# Altium schematic sheet 07-USB.SchDoc
size B
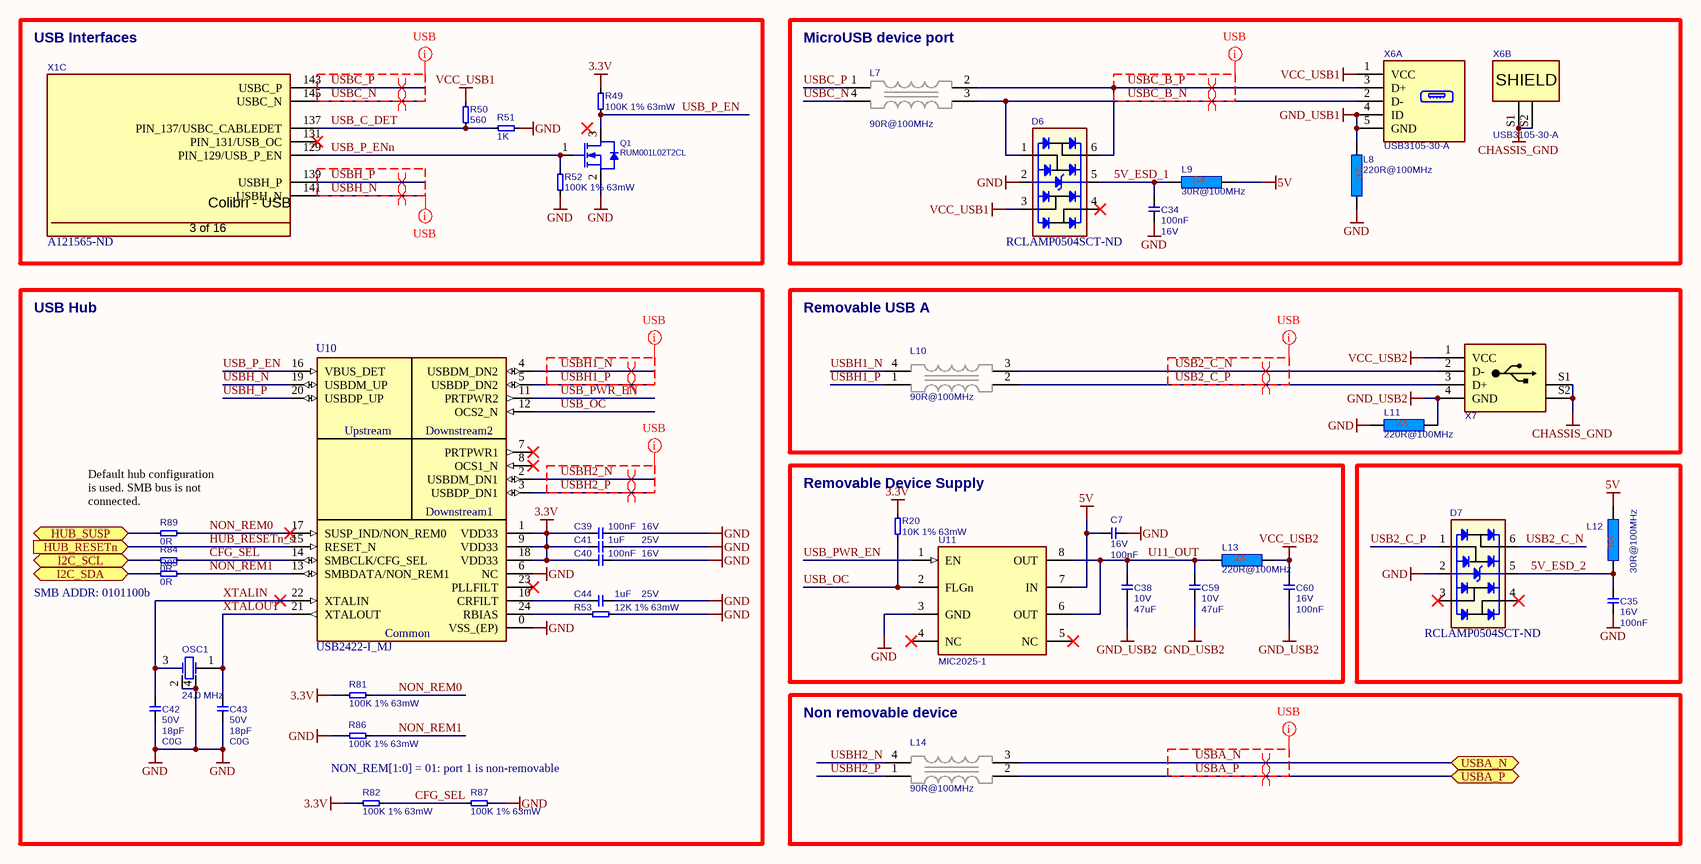
[diagram p0: 07-USB.SchDoc]

## Parts
C7  value 100nF  Rating: 16V  [CAPC1005X60N]  (hidden comment: 100nF 16V 10% X7R)
C34  value 100nF  Rating: 16V  [CAPC1005X60N]  (hidden comment: 100nF 16V 10% X7R)
C35  value 100nF  Rating: 16V  [CAPC1005X60N]  (hidden comment: 100nF 16V 10% X7R)
C38  value 47uF  Rating: 10V  [CAPC3225X160N]  (hidden comment: 47uF 10V 20% X5R)
C39  value 100nF  Rating: 16V  [CAPC1005X60N]  (hidden comment: 100nF 16V 10% X7R)
C40  value 100nF  Rating: 16V  [CAPC1005X60N]  (hidden comment: 100nF 16V 10% X7R)
C41  value 1uF  Rating: 25V  [T_CAPC0805X125N]  (hidden comment: 1uF 25V 10% X7R)
C42  value 18pF  Rating: 50V  Type: C0G  [T_CAPC0603X33N]  (hidden comment: 18pF 50V 5% C0G)
C43  value 18pF  Rating: 50V  Type: C0G  [T_CAPC0603X33N]  (hidden comment: 18pF 50V 5% C0G)
C44  value 1uF  Rating: 25V  [T_CAPC0805X125N]  (hidden comment: 1uF 25V 10% X7R)
C59  value 47uF  Rating: 10V  [CAPC3225X160N]  (hidden comment: 47uF 10V 20% X5R)
C60  value 100nF  Rating: 16V  [CAPC1005X60N]  (hidden comment: 100nF 16V 10% X7R)
D6  Supplier Part Number 1: RCLAMP0504SCT-ND  [T_SOT95P285X90-6N]  (hidden comment: RCLAMP0504S)
D7  Supplier Part Number 1: RCLAMP0504SCT-ND  [T_SOT95P285X90-6N]  (hidden comment: RCLAMP0504S)
L7  value 90R@100MHz  [T_Murata_DLW21SN900SQ2]  (hidden comment: DLW21SN900SQ2)
L8  value 220R@100MHz  [INDC2012X140N]  (hidden comment: BLM21PG221SN1D)
L9  value 30R@100MHz  [INDC1608X95N]  (hidden comment: BLM18KG300TN1D)
L10  value 90R@100MHz  [T_Murata_DLW21SN900SQ2]  (hidden comment: DLW21SN900SQ2)
L11  value 220R@100MHz  [INDC2012X140N]  (hidden comment: BLM21PG221SN1D)
L12  value 30R@100MHz  [INDC1608X95N]  (hidden comment: BLM18KG300TN1D)
L13  value 220R@100MHz  [INDC2012X140N]  (hidden comment: BLM21PG221SN1D)
L14  value 90R@100MHz  [T_Murata_DLW21SN900SQ2]  (hidden comment: DLW21SN900SQ2)
OSC1  value 24.0 MHz  [XTAL3.2x2.5]  (hidden comment: CRYSTAL 24.0000MHZ 18PF SMD)
Q1  RUM001L02T2CL  [TRANS_RUM001_ROM]
R20  10K 1% 63mW  [RESC1005X40N]
R49  100K 1% 63mW  [RESC1005X40N]
R50  value 560  [RESC1005X40N]  (hidden comment: 560R 1% 63mW)
R51  value 1K  [RESC1005X40N]  (hidden comment: 1K 1% 63mW)
R52  100K 1% 63mW  [RESC1005X40N]
R53  12K 1% 63mW  [RESC1005X40N]
R81  100K 1% 63mW  [RESC1005X40N]
R82  100K 1% 63mW  [RESC1005X40N]
R84  0R  [RESC1005X40N]
R85  0R  [RESC1005X40N]
R86  100K 1% 63mW  [RESC1005X40N]
R87  100K 1% 63mW  [RESC1005X40N]
R89  0R  [RESC1005X40N]
U10  USB2422-I_MJ  [QFN50P400X400X80-25N]
U11  MIC2025-1  [SOIC127P600X175-8N]
X1  Supplier Part Number 1: A121565-ND  [T_Tyco_1473005-1]  (hidden comment: 1473005-1)  (part C of 16)
X6  USB3105-30-A  [T_GCT_USB3105-30-A]  (parts A,B of 2)
X7  UE27AE54100  [T_FCI_UE27AE54100]  (value not drawn)

## Blocks framed on the sheet
USB Interfaces: Q1 R49-R52 X1
MicroUSB device port: C34 D6 L7-L9 X6
USB Hub: C39-C44 OSC1 R53 R81 R82 R84-R87 R89 U10
Removable USB A: L10 L11 X7
Removable Device Supply: C7 C38 C59 C60 L13 R20 U11
Non removable device: L14

## Ports
HUB_RESETn (in), HUB_SUSP (bidir), I2C_SCL (bidir), I2C_SDA (bidir), USBA_N (bidir), USBA_P (bidir)

## Nets
3.3V: C39.2 C40.2 C41.2 R20.1 R49.2 R81.2 R82.2 U10.1(VDD33) U10.9(VDD33) U10.18(VDD33)
5V: C7.2 L9.1 L12.1 U11.7(IN)
CHASSIS_GND: X6.S1(SHIELD) X6.S2(SHIELD) X7.S1 X7.S2
GND: C7.1 C34.1 C35.1 C39.1 C40.1 C41.1 C42.1 C43.1 C44.1 D6.2 D7.2 L8.1 L11.2 OSC1.2 OSC1.4 Q1.2(D) R51.2 R52.2 R53.2 R86.1 R87.1 U10.0(VSS_(EP)) U10.6(NC) U11.3(GND)
GND_USB1: L8.2 X6.4(ID) X6.5(GND)
GND_USB2: C38.1 C59.1 C60.1 L11.1 X7.4(GND)
VCC_USB1: D6.3 R50.1 X6.1(VCC)
VCC_USB2: C60.2 L13.1 X7.1(VCC)
5V_ESD_1: C34.2 D6.5 L9.2
5V_ESD_2: C35.2 D7.5 L12.2
CFG_SEL: R82.1 R84.1 R87.2 U10.14(SMBCLK/CFG_SEL)
HUB_RESETn_s: U10.15(RESET_N) ; port HUB_RESETn
HUB_SUSP: R89.2 ; port HUB_SUSP
I2C_SCL: R84.2 ; port I2C_SCL
I2C_SDA: R85.2 ; port I2C_SDA
NON_REM0: R81.1 R89.1 U10.17(SUSP_IND/NON_REM0)
NON_REM1: R85.1 R86.2 U10.13(SMBDATA/NON_REM1)
U11_OUT: C38.2 C59.2 L13.2 U11.6(OUT) U11.8(OUT)
USB2_C_N: D7.6 L10.3 X7.2(D-)
USB2_C_P: D7.1 L10.2 X7.3(D+)
USB_C_DET: R50.2 R51.1 X1.137(PIN_137/USBC_CABLEDET)
USB_OC: R20.2 U10.12(OCS2_N) U11.2(FLGn)
USB_P_EN: Q1.3(S) R49.1 U10.16(VBUS_DET)
USB_P_ENn: Q1.1(G) R52.1 X1.129(PIN_129/USB_P_EN)
USB_PWR_EN: U10.11(PRTPWR2) U11.1(EN)
USBA_N: L14.3 ; port USBA_N
USBA_P: L14.2 ; port USBA_P
USBC_B_N: D6.1 L7.3 X6.2(D-)
USBC_B_P: D6.6 L7.2 X6.3(D+)
USBC_N: L7.4 X1.145(USBC_N)
USBC_P: L7.1 X1.143(USBC_P)
USBH1_N: L10.4 U10.4(USBDM_DN2)
USBH1_P: L10.1 U10.5(USBDP_DN2)
USBH2_N: L14.4 U10.2(USBDM_DN1)
USBH2_P: L14.1 U10.3(USBDP_DN1)
USBH_N: U10.19(USBDM_UP) X1.141(USBH_N)
USBH_P: U10.20(USBDP_UP) X1.139(USBH_P)
XTALIN: C42.2 OSC1.3(OSC2) U10.22(XTALIN)
XTALOUT: C43.2 OSC1.1(OSC1) U10.21(XTALOUT)
NetC44_2: C44.2 U10.10(CRFILT)
NetR53_1: R53.1 U10.24(RBIAS)

Not connected (* = marked no-connect by the designer): D6 4*; D7 3* 4*; U10 7(PRTPWR1)* 8(OCS1_N)* 23(PLLFILT)*; U11 4(NC)* 5(NC)*; X1 131(PIN_131/USB_OC)*

## Layout directives
differential pair: USB2_C_N, USB2_C_P, USBA_N, USBA_P, USBC_B_N, USBC_B_P, USBC_N, USBC_P, USBH1_N, USBH1_P, USBH2_N, USBH2_P, USBH_N, USBH_P
net class USB: USB2_C_N, USB2_C_P, USBA_N, USBA_P, USBC_B_N, USBC_B_P, USBC_N, USBC_P, USBH1_N, USBH1_P, USBH2_N, USBH2_P, USBH_N

## Notes on the sheet
- (near R89) Default hub configuration is used. SMB bus is not connected.
- SMB ADDR: 0101100b
- NON_REM[1:0] = 01: port 1 is non-removable
- (in symbol CON-Tyco-1473005-1-200-0.6mm, part C) Colibri - USB; 3 of 16
- (in symbol IC-Microchip-USB2422-I_MJ) Upstream; Downstream2; Downstream1; Common
- (in symbol L-Murata-30R@100MHz-5A-0603) 5A
- (in symbol L-Murata-220R@100MHz-2A-0805) 2A

## Library data of the parts
C7 C34 C35 C39 C40 C60 = C-100nF-16V-10%-0603: Capacitor Ceramic X7R 100nF 16V 10% 0603; FP_DESC: C0402; Tolerance: 10%; Type: X7R; Supplier 1: Digi-Key; Supplier Part Number 1: 1276-1001-1-ND; Footprint Checked: -; MFG: *; MFG_PN: *
C38 C59 = C-47uF-10V-20%-1210: Capacitor Ceramic X5R 47uF 10V 20% 1210; FP_DESC: C1210; Tolerance: 20%; Type: X5R; Supplier 1: Digi-Key; Supplier Part Number 1: 445-6711-1-ND; MFG: *; MFG_PN: *
C41 C44 = C-1uF-25V-10%-0805: Capacitor Ceramic X7R 1uF 25V 10% 0805; FP_DESC: C0805; Tolerance: 10%; Type: X7R; Supplier 1: Digi-Key; Supplier Part Number 1: 399-8004-1-ND; MFG: *; MFG_PN: *
C42 C43 = C-18pF-50V-5%-0603: Capacitor Ceramic C0G 18pF 50V 5% 0603; FP_DESC: C0603; Tolerance: 5%; Supplier 1: Digi-Key; Supplier Part Number 1: 311-1061-1-ND; MFG: *; MFG_PN: *
D6 D7 = D-Semtech-RClamp0504S: TVS Array low cap; Supplier 1: Digi-Key; Footprint Checked: -; MFG: Semtech; MFG_PN: RCLAMP0504S; Symbol Checked: -
L7 L10 L14 = L-Murata-DLW21SN900SQ2-90R@100MHz-330mA-25%: Common Mode Choke High Speed 90R 330mA; Tolerance: 25%; MFG: Murata; Rating: 330mA; Supplier 1: Digi-Key; Supplier Part Number 1: 490-5137-1-ND; Footprint Checked: -; MFG_PN: DLW21SN900SQ2; Symbol Checked: -
L8 L11 L13 = L-Murata-220R@100MHz-2A-0805: 220 Ohms @ 100MHz 1 Power Line Ferrite Bead 0805 (2012 Metric) 2A 45mOhm; Rating: 4A; Tolerance: 25%; MFG: EXC-ML20A390U; Supplier 1: Digi-Key; Supplier Part Number 1: 490-1054-1-ND; Footprint Checked: -; Symbol Checked: -
L9 L12 = L-Murata-30R@100MHz-5A-0603: 30 Ohms @ 100MHz 1 Power Line Ferrite Bead 0603 (1608 Metric) 5A 10mOhm; Rating: 4A; Tolerance: 25%; MFG: EXC-ML20A390U; Supplier 1: Digi-Key; Supplier Part Number 1: 490-5447-1-ND; Footprint Checked: Ok, Assign Ok; Symbol Checked: -
OSC1 = OSC-ABM8G-24.000MHZ-18-D2Y-T: 24MHz ±20ppm Crystal 18pF 60 Ohms 4-SMD, No Lead; Tolerance: 30ppm; MFG: HORIZON; MFG_PN: HEX24-24000MHz-18-50R-F-H2-T2-W2-T; Supplier 1: Digi-Key; Supplier Part Number 1: 535-10273-1-ND; Footprint Checked: -; Symbol Checked: -
Q1 = T-Rohm-RUM001L02T2CL: N-Channel 20V 100mA (Ta) 150mW (Ta) Surface Mount VMT3; FP_DESC: SOT-723; MFG: Rohm Semiconductor Inc.; MFG_PN: RUM001L02T2CL; Footprint Checked: Ok; Supplier 1: Digi-Key; Supplier Part Number 1: RUM001L02T2CLCT-ND; Symbol Checked: -
R20 = R-10K-1%-0402: Resistor 10Kohm 63mW 1% 0402; MFG: <GENERIC>; Power: 63mW; Tolerance: 1%; Value: 10k; Footprint: R0402; Supplier 1: Digi-Key; Supplier Part Number 1: 541-10.0KLDKR-ND; Footprint Checked: -; MFG_PN: <GENERIC>; Symbol Checked: -
R49 R52 R81 R82 R86 R87 = R-100K-1%-0402: Resistor 100Kohm 63mW 1% 0402; Manufacturer: <GENERIC>; Replacement Allowed: Yes; Power: 63mW; Tolerance: 1%; Value: 100k; Footprint: R0402; Supplier 1: Digi-Key; Supplier Part Number 1: 541-100KLCT-ND; Manufacturer Part Number: <GENERIC>
R50 = R-560R-1%-0402: Resistor 560ohm 63mW 1% 0402; MFG: <GENERIC>; Tolerance: 1%; Power: 63mW; Footprint: R0402; Supplier 1: Digi-Key; Supplier Part Number 1: 13-AC0402FR-07560RLCT-ND; Footprint Checked: -; MFG_PN: <GENERIC>; Symbol Checked: -
R51 = R-1K-1%-0402: Resistor 1Kohm 63mW 1% 0402; MFG: <GENERIC>; Tolerance: 1%; Power: 63mW; Footprint: R0402; Supplier 1: Digi-Key; Supplier Part Number 1: 541-1.00KLCT-ND; Footprint Checked: -; MFG_PN: <GENERIC>; Symbol Checked: -
R53 = R-12K-1%-0402: Resistor 12Kohm 63mW 1% 0402; MFG: <GENERIC>; Symbol Checked: T; Tolerance: 1%; Value: 12K; Power: 63mW; Footprint: R0402; Supplier 1: Digi-Key; Supplier Part Number 1: 541-4063-1-ND; Footprint Checked: -; MFG_PN: <GENERIC>
R84 R85 R89 = R-0R-0402: Resistor 0ohm 0402; Tolerance: 1%; MFG: <GENERIC>; Power: ?; Value: 0R; Footprint: R0402; Supplier 1: Digi-Key; Supplier Part Number 1: 541-2952-1-ND; Footprint Checked: -; MFG_PN: <GENERIC>; Symbol Checked: -
U10 = IC-Microchip-USB2422-I_MJ: USB Hub Controller USB 2.0 USB Interface 24-QFN (4x4); Supplier 1: Digi-Key; Supplier Part Number 1: USB2422-I/MJ-ND; Footprint Checked: -; Symbol Checked: -
U11 = IC-Microchip-MIC2025-1: Power Switch/Driver 1:1 N-Channel 500mA 8-MSOP; Symbol Checked: T; MFG: Texas Instruments; Supplier 1: Digi-Key; Supplier Part Number 1: MIC2025-1YM-CT-ND; Footprint Checked: -; MFG_PN: MIC2025
X1 = CON-Tyco-1473005-1-200-0.6mm: SODIMM Connector; Manufacturer Name: Tyco; No. of ways: 200; Supplier 1: Digi-Key; Manufacturer Part No.: 1473005-1
X6 = CON-GCT-USB3105-30-A: Micro USB OTG Connector - TH - Vertical; No. of ways: 5; MFG: GCT; Supplier 1: Digi-Key; Supplier Part Number 1: 2073-USB3105-30-ACT-ND; Footprint Checked: -; MFG_PN: USB3105-30-A; Symbol Checked: -
X7 = CON-FCI-UE27AE54100: USB Type A Connector; Manufacturer Name: FCI; No. of ways: 4; Supplier 1: Digi-Key; Supplier Part Number 1: UE27AE54100-ND; Manufacturer Part No.: UE27AE54100